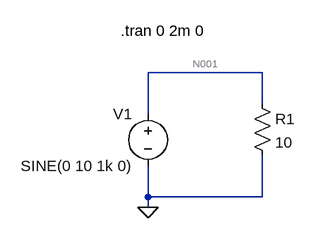
[diagram p0: schematic Draft2.asc]
Draft2.asc, the LTspice schematic file:
Version 4
SHEET 1 880 680
WIRE 272 64 96 64
WIRE 272 112 272 64
WIRE 96 128 96 64
WIRE 96 256 96 208
WIRE 272 256 272 192
WIRE 272 256 96 256
WIRE 96 272 96 256
FLAG 96 272 0
SYMBOL voltage 96 112 M0
WINDOW 123 0 0 Left 0
WINDOW 39 0 0 Left 0
SYMATTR InstName V1
SYMATTR Value SINE(0 10 1k 0)
SYMBOL res 256 96 R0
SYMATTR InstName R1
SYMATTR Value 10
TEXT 184 0 Right 2 !.tran 0 2m 0

The netlist it stands for:
* Draft2.asc
V1 N001 0 SINE(0 10 1k 0)
R1 N001 0 10
.tran 0 2m 0
.backanno
.end

* Results of the author's LTspice run, read from the files saved beside the schematic
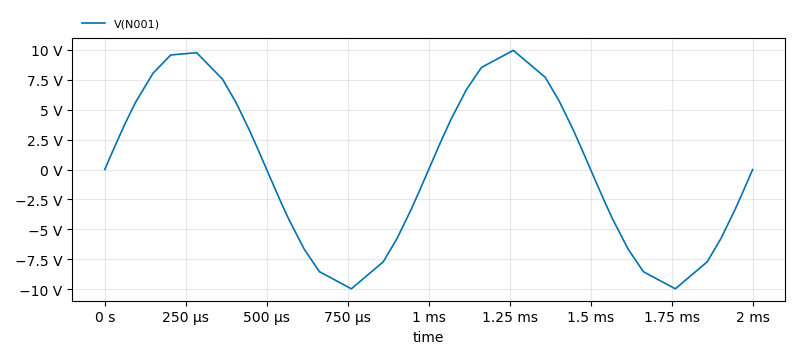
[diagram p1: Transient Analysis of Draft2.asc, plotted from the saved traces]
* Transient Analysis, 1 run:
*   V(N001): min -9.966 V, max 9.966 V, average 11.85 mV, rms 6.956 V, last 0 V